# Altium schematic sheet P05_AM335x 3_3.SchDoc
size 513 x 386 mm
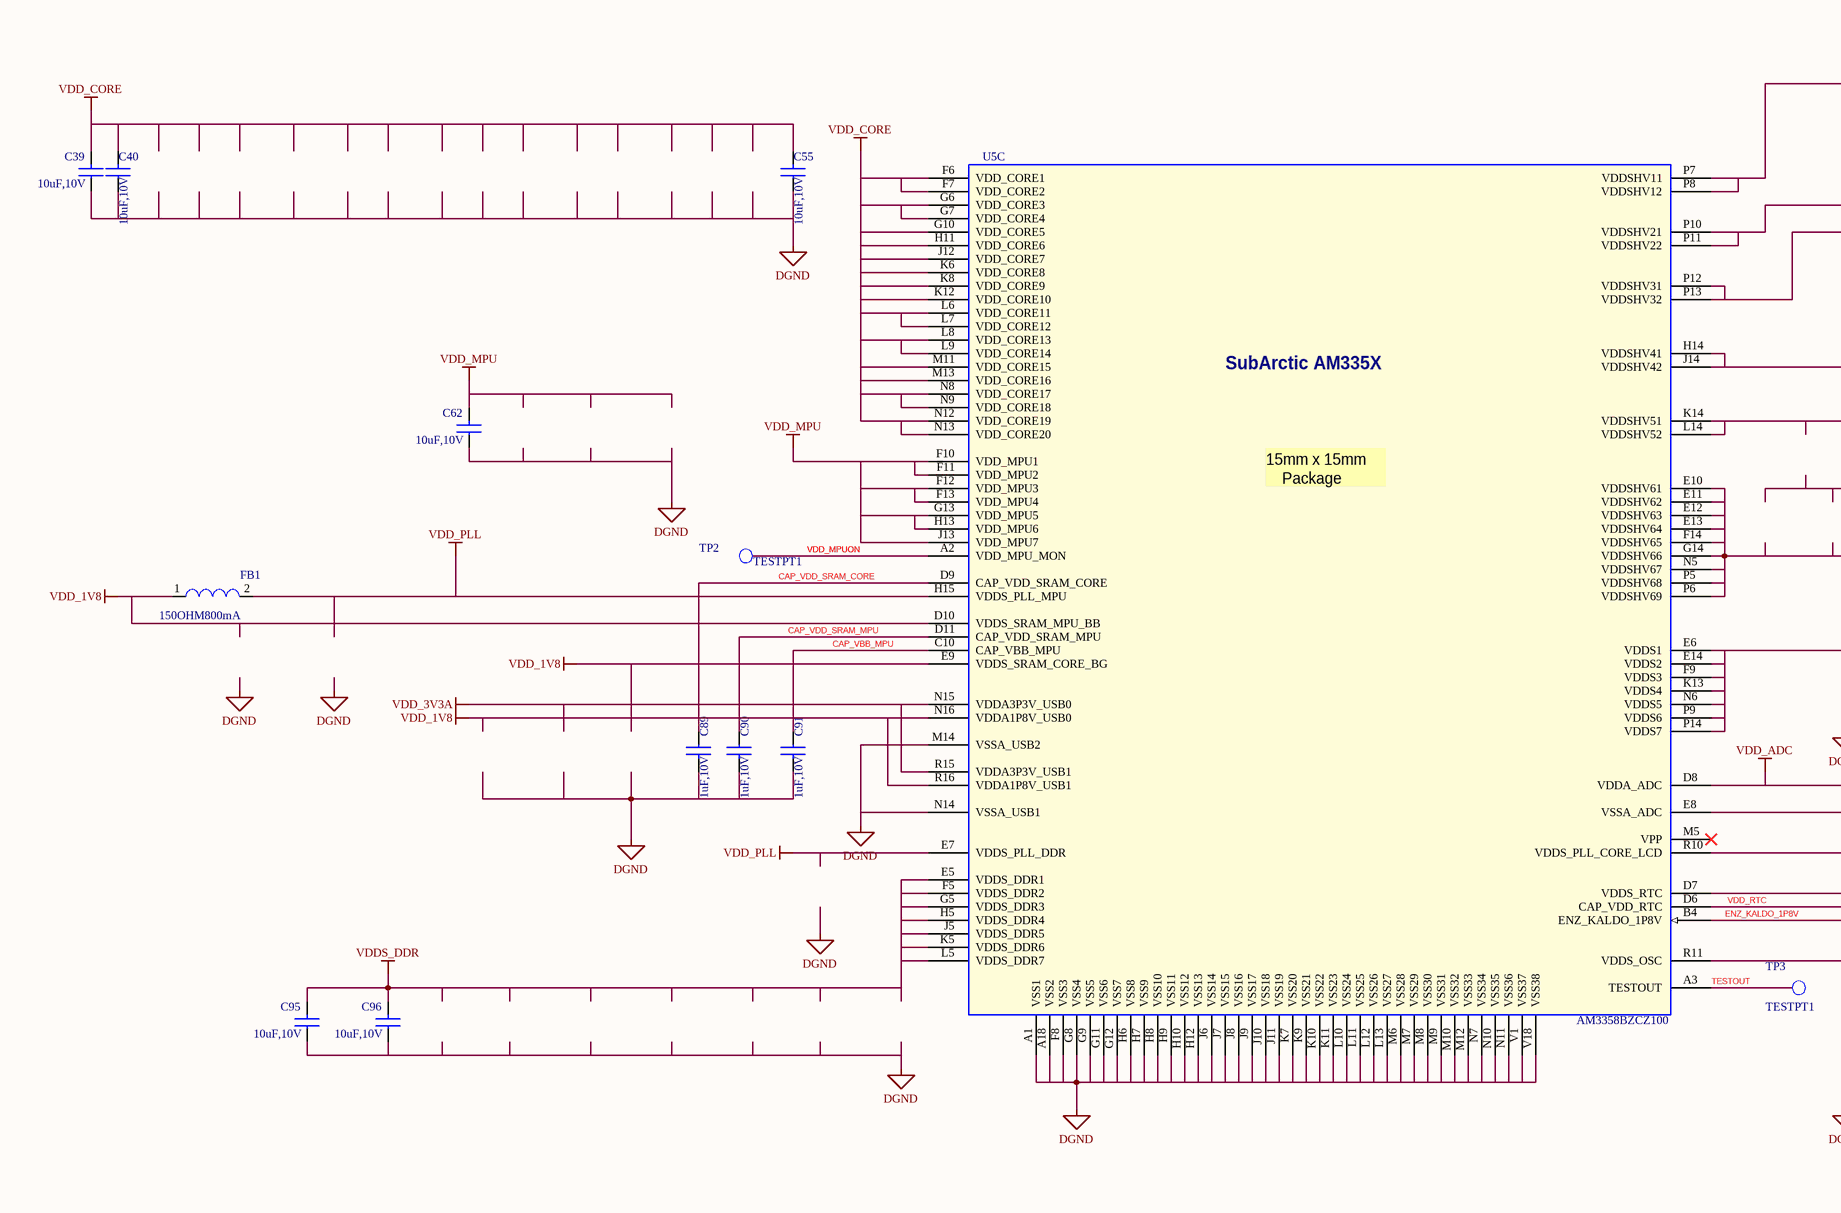
[diagram p0: P05_AM335x 3_3.SchDoc, left]
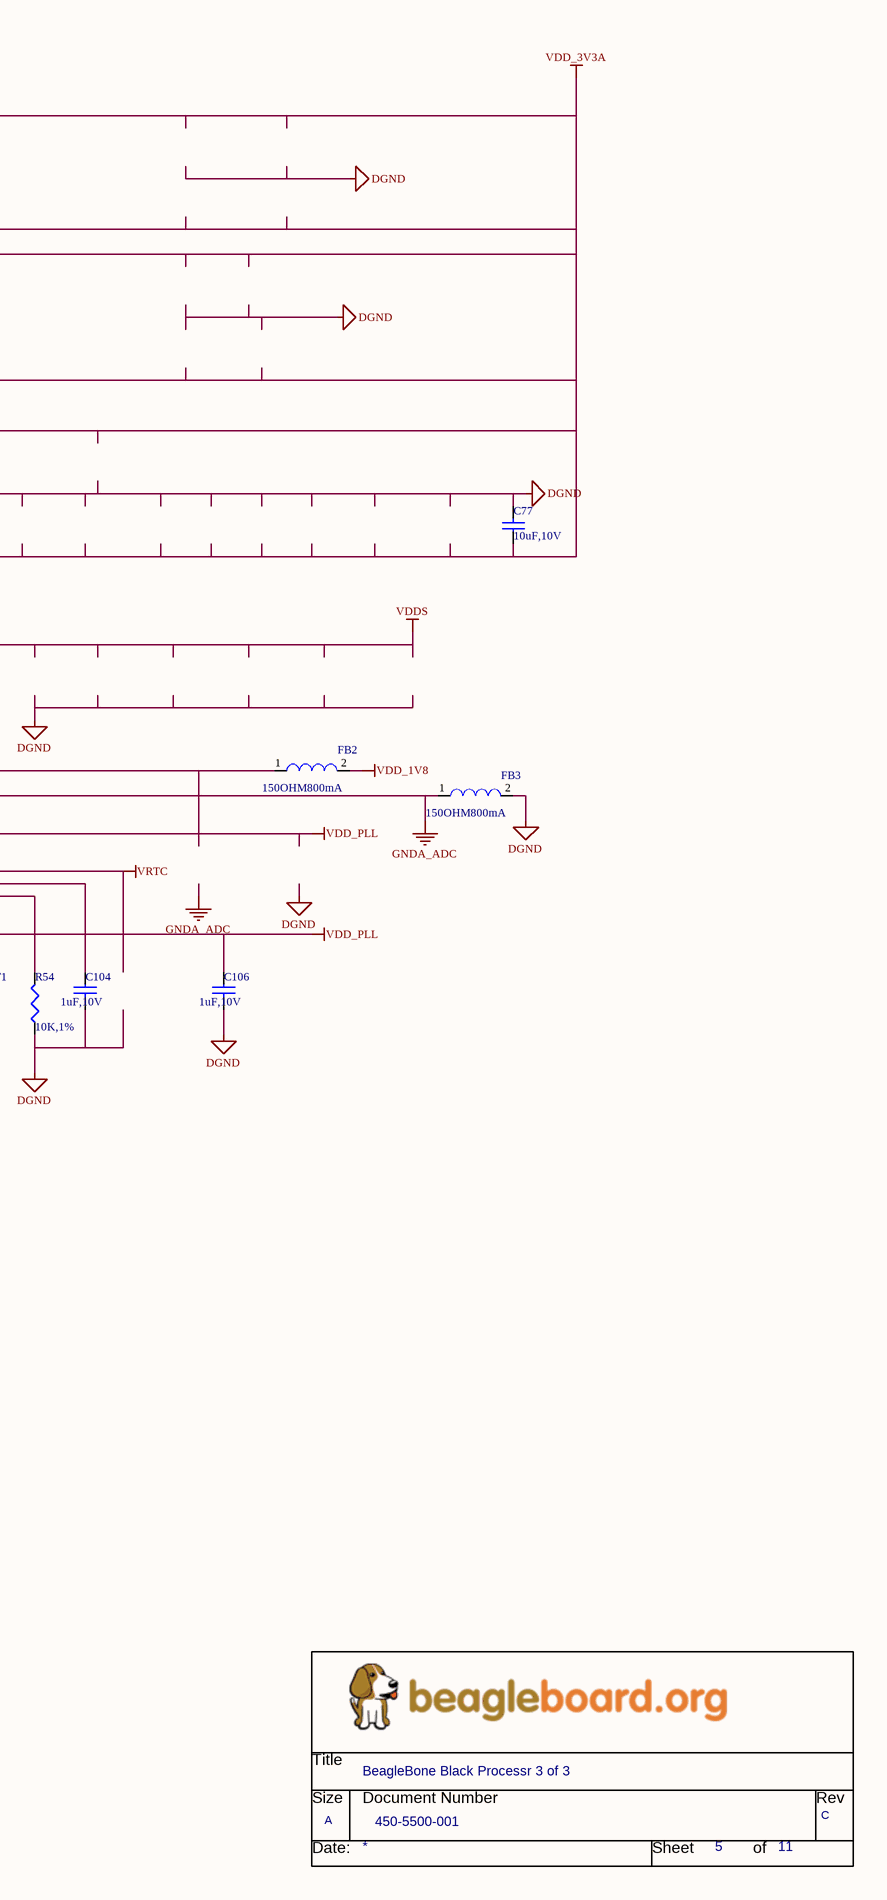
[diagram p1: P05_AM335x 3_3.SchDoc, right]

## Parts
*  Page Count: 11  Page Number: 5  Page Size: A  Title: BeagleBone Black Processr 3 of 3  RevCode: C  Doc: 450-5500-001  (hidden comment: BeagleBoard_org)  (graphical)
C39  10uF,10V  [r402-25rd]
C40  10uF,10V  [r402-25rd]
C55  10uF,10V  [r402-25rd]
C62  10uF,10V  [r402-25rd]
C77  10uF,10V  [r402-25rd]
C89  1uF,10V  [402]
C90  1uF,10V  [402]
C91  1uF,10V  [402]
C95  10uF,10V  [r402-25rd]
C96  10uF,10V  [r402-25rd]
C104  1uF,10V  [402]
C106  1uF,10V  [402]
FB1  150OHM800mA  [L0805]
FB2  150OHM800mA  [L0805]
FB3  150OHM800mA  [L0805]
R54  10K,1%  [402]
TP2  TESTPT1  [tp1-8040]
TP3  TESTPT1  [tp1-8040]
U5  AM3358BZCZ100  [am33xx_15x15]  (part C of 3)

## Nets
DGND: C39.1 C40.1 C55.1 C62.1 C77.2 C89.2 C90.2 C91.2 C95.1 C96.1 C104.2 C106.2 FB3.2 R54.1 U5.A1(VSS1) U5.A18(VSS2) U5.F8(VSS3) U5.G8(VSS4) U5.G9(VSS5) U5.G11(VSS6) U5.G12(VSS7) U5.H6(VSS8) U5.H7(VSS9) U5.H8(VSS10) U5.H9(VSS11) U5.H10(VSS12) U5.H12(VSS13) U5.J6(VSS14) U5.J7(VSS15) U5.J8(VSS16) U5.J9(VSS17) U5.J10(VSS18) U5.J11(VSS19) U5.K7(VSS20) U5.K9(VSS21) U5.K10(VSS22) U5.K11(VSS23) U5.L10(VSS24) U5.L11(VSS25) U5.L12(VSS26) U5.L13(VSS27) U5.M6(VSS28) U5.M7(VSS29) U5.M8(VSS30) U5.M9(VSS31) U5.M10(VSS32) U5.M12(VSS33) U5.M14(VSSA_USB2) U5.N7(VSS34) U5.N10(VSS35) U5.N11(VSS36) U5.N14(VSSA_USB1) U5.V1(VSS37) U5.V18(VSS38)
GNDA_ADC: FB3.1 U5.E8(VSSA_ADC)
VDD_1V8: FB1.1 FB2.2 U5.D10(VDDS_SRAM_MPU_BB) U5.E9(VDDS_SRAM_CORE_BG) U5.N16(VDDA1P8V_USB0) U5.R16(VDDA1P8V_USB1)
VDD_3V3A: C77.1 U5.E10(VDDSHV61) U5.E11(VDDSHV62) U5.E12(VDDSHV63) U5.E13(VDDSHV64) U5.F14(VDDSHV65) U5.G14(VDDSHV66) U5.H14(VDDSHV41) U5.J14(VDDSHV42) U5.K14(VDDSHV51) U5.L14(VDDSHV52) U5.N5(VDDSHV67) U5.N15(VDDA3P3V_USB0) U5.P5(VDDSHV68) U5.P6(VDDSHV69) U5.P7(VDDSHV11) U5.P8(VDDSHV12) U5.P10(VDDSHV21) U5.P11(VDDSHV22) U5.P12(VDDSHV31) U5.P13(VDDSHV32) U5.R15(VDDA3P3V_USB1)
VDD_ADC: FB2.1 U5.D8(VDDA_ADC)
VDD_CORE: C39.2 C40.2 C55.2 U5.F6(VDD_CORE1) U5.F7(VDD_CORE2) U5.G6(VDD_CORE3) U5.G7(VDD_CORE4) U5.G10(VDD_CORE5) U5.H11(VDD_CORE6) U5.J12(VDD_CORE7) U5.K6(VDD_CORE8) U5.K8(VDD_CORE9) U5.K12(VDD_CORE10) U5.L6(VDD_CORE11) U5.L7(VDD_CORE12) U5.L8(VDD_CORE13) U5.L9(VDD_CORE14) U5.M11(VDD_CORE15) U5.M13(VDD_CORE16) U5.N8(VDD_CORE17) U5.N9(VDD_CORE18) U5.N12(VDD_CORE19) U5.N13(VDD_CORE20)
VDD_MPU: C62.2 U5.F10(VDD_MPU1) U5.F11(VDD_MPU2) U5.F12(VDD_MPU3) U5.F13(VDD_MPU4) U5.G13(VDD_MPU5) U5.H13(VDD_MPU6) U5.J13(VDD_MPU7)
VDD_PLL: C106.1 FB1.2 U5.E7(VDDS_PLL_DDR) U5.H15(VDDS_PLL_MPU) U5.R10(VDDS_PLL_CORE_LCD) U5.R11(VDDS_OSC)
VDDS: U5.E6(VDDS1) U5.E14(VDDS2) U5.F9(VDDS3) U5.K13(VDDS4) U5.N6(VDDS5) U5.P9(VDDS6) U5.P14(VDDS7)
VDDS_DDR: C95.2 C96.2 U5.E5(VDDS_DDR1) U5.F5(VDDS_DDR2) U5.G5(VDDS_DDR3) U5.H5(VDDS_DDR4) U5.J5(VDDS_DDR5) U5.K5(VDDS_DDR6) U5.L5(VDDS_DDR7)
VRTC: U5.D7(VDDS_RTC)
CAP_VBB_MPU: C91.1 U5.C10(CAP_VBB_MPU)
CAP_VDD_SRAM_CORE: C89.1 U5.D9(CAP_VDD_SRAM_CORE)
CAP_VDD_SRAM_MPU: C90.1 U5.D11(CAP_VDD_SRAM_MPU)
ENZ_KALDO_1P8V: R54.2 U5.B4(ENZ_KALDO_1P8V)
TESTOUT: TP3.1(TP) U5.A3(TESTOUT)
VDD_MPUON: TP2.1(TP) U5.A2(VDD_MPU_MON)
VDD_RTC: C104.1 U5.D6(CAP_VDD_RTC)

Not connected (* = marked no-connect by the designer): U5 M5(VPP)*

## Notes on the sheet
- (in symbol BeagleBoard_org) Title; Size; Document Number; Rev; Date:; Sheet; of
- (in symbol IC_AM335X_ZCZ, part C) SubArctic AM335X; 15mm x 15mm / Package

## Library data of the parts
C39 C40 C55 C62 C77 C95 C96 = CAP_10uF_Y5V_10V_10%_0805: Desc: CAP CER 10UF 10V Y5V 0805; PCB Footprint: 805; Part Number: CAP_10uF_Y5V_10V_10%_0805
C89-C91 C104 C106 = CAP_1.0UF_X5R_10V_10%_0402: Desc: CAP, CER, X7R, 0402, 50V, 10%, 0.1uF; Part Number: CAP_1.0uF_X5R_10V_10%_0402; PCB Footprint: 402
FB1-FB3 = FER_180_200_0: Ferrite Bead 150 Ohm 800mA; Part Number: FER_180_200_0805; TIIntPartnumber: 1L0010; MfrNum: LI0805H151R-10; Mfr: Steward; PCB Footprint: 805; Vendor: Digikey; PartName: FerriteBead150ohm800mA
R54 = RES_10K_1/16W_1%_0402_Dup1: Resistor 10Kohm 1/16W 1% 0402; Part Number: RES_10K_1/16W_1%_0402; PCB Footprint: 402
TP2 TP3 = TESTPT1: PCB Footprint: TP60C_SMD
U5 = IC_AM335X_ZCZ: SubArctic Cortex A8 Processor 15x15; Part Number: IC_AM335x_ZCE; TIIntPartnumber: 1A0242; MfrNum: AM335x 15x15 FBGA ZCE; Mfr: TI; PartName: AM335X_15x15; PCB Footprint: FBGAZCZ15x15_tbd; Vendor: Arrow; Cost10K: 10.00; Cost100: 10.00
* = BeagleBoard_org: Page Create Date: March  8, 1995; Page Modify Date: *